# Altium schematic sheet 5V_LED_Indicator.SchDoc
size A; SheetNumber: 1; SheetTotal: 1
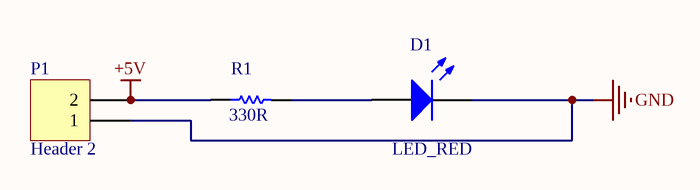
[diagram p0: 5V_LED_Indicator.SchDoc]

## Parts
D1  LED_RED  [LED-1]
P1  Header 2  [HDR1X2]
R1  value 330R  [AXIAL-0.3]  (hidden comment: Resistor)

## Nets
+5V: P1.2 R1.1
GND: D1.2(K) P1.1
NetD1_1: D1.1(A) R1.2

## Library data of the parts
D1 = LED: Light-Emitting Diode; AF: 1; BV: 0; BV_MAX: 1e99; EG: 1.11; FC: 0.5; IBV: 0.001; IS: 1e-14; MJSW: 0.33; NTUN: 30; TNOM: 27; XTI: 3; SimulationGenericComponent: True; CJO: 0; CJP: 0; CTA: 0; CTP: 0; FCS: 0.5; FV_MAX: 1e99; IKF: 0; IKR: 0; ISR: 1e-14; JSW: 0; JTUN: 0; JTUNSW: 0; KEG: 1; KF: 0; LEVEL: 1; N: 1; NBV: 1; NR: 1; NS: 1; PHP: 1; RS: 0; TCV: 0; TLEV: 0; TLEVC: 0; TM1: 0; TM2: 0; TPB: 0; TPHP: 0; TRS: 0; TRS2: 0; TT: 0; TTT1: 0; TTT2: 0; VJ: 1; XTITUN: 3
P1 = Header 2: Header, 2-Pin; LatestRevisionDate: 17-Jul-2002; LatestRevisionNote: Re-released for DXP Platform.; Publisher: Altium Limited
R1 = Resistor: TC1: 0; SimulationGenericComponent: True; TC2: 0